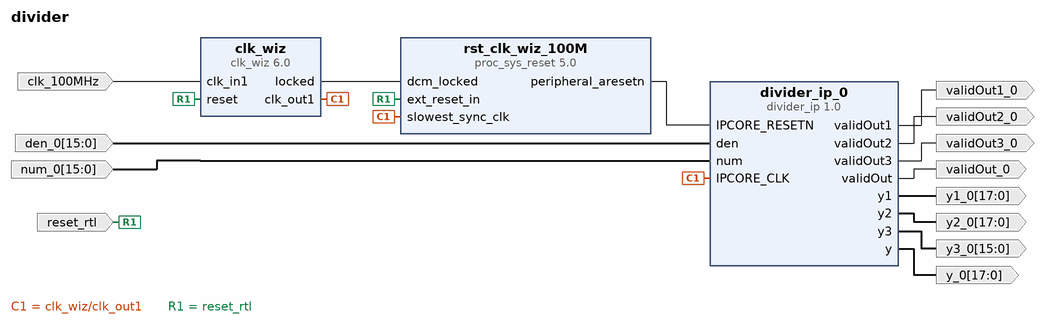
[diagram p0: block diagram of the top level]
# Vivado block design divider, xc7z010clg400-1, Vivado 2023.2
create_bd_design divider

create_bd_port -dir I -type clk clk_100MHz
set_property -dict {CONFIG.FREQ_HZ 100000000} [get_bd_ports clk_100MHz]
create_bd_port -dir I -type rst reset_rtl
set_property -dict {CONFIG.POLARITY ACTIVE_HIGH} [get_bd_ports reset_rtl]
create_bd_port -dir I -from 15 -to 0 den_0
create_bd_port -dir I -from 15 -to 0 num_0
create_bd_port -dir O validOut_0
create_bd_port -dir O validOut1_0
create_bd_port -dir O validOut2_0
create_bd_port -dir O validOut3_0
create_bd_port -dir O -from 17 -to 0 y_0
create_bd_port -dir O -from 17 -to 0 y1_0
create_bd_port -dir O -from 17 -to 0 y2_0
create_bd_port -dir O -from 15 -to 0 y3_0

create_bd_cell -type ip -vlnv user.org:ip:divider_ip:1.0 divider_ip_0
create_bd_cell -type ip -vlnv xilinx.com:ip:clk_wiz:6.0 clk_wiz
create_bd_cell -type ip -vlnv xilinx.com:ip:proc_sys_reset:5.0 rst_clk_wiz_100M

# ---- connections ----

connect_bd_net [get_bd_ports clk_100MHz] [get_bd_pins clk_wiz/clk_in1]
connect_bd_net [get_bd_pins clk_wiz/clk_out1] [get_bd_pins divider_ip_0/IPCORE_CLK] [get_bd_pins rst_clk_wiz_100M/slowest_sync_clk]
connect_bd_net [get_bd_pins clk_wiz/locked] [get_bd_pins rst_clk_wiz_100M/dcm_locked]
connect_bd_net -net den_0_1 [get_bd_ports den_0] [get_bd_pins divider_ip_0/den]
connect_bd_net [get_bd_pins divider_ip_0/validOut] [get_bd_ports validOut_0]
connect_bd_net [get_bd_pins divider_ip_0/validOut1] [get_bd_ports validOut1_0]
connect_bd_net [get_bd_pins divider_ip_0/validOut2] [get_bd_ports validOut2_0]
connect_bd_net [get_bd_pins divider_ip_0/validOut3] [get_bd_ports validOut3_0]
connect_bd_net [get_bd_pins divider_ip_0/y] [get_bd_ports y_0]
connect_bd_net [get_bd_pins divider_ip_0/y1] [get_bd_ports y1_0]
connect_bd_net [get_bd_pins divider_ip_0/y2] [get_bd_ports y2_0]
connect_bd_net [get_bd_pins divider_ip_0/y3] [get_bd_ports y3_0]
connect_bd_net -net num_0_1 [get_bd_ports num_0] [get_bd_pins divider_ip_0/num]
connect_bd_net [get_bd_ports reset_rtl] [get_bd_pins clk_wiz/reset] [get_bd_pins rst_clk_wiz_100M/ext_reset_in]
connect_bd_net [get_bd_pins rst_clk_wiz_100M/peripheral_aresetn] [get_bd_pins divider_ip_0/IPCORE_RESETN]

validate_bd_design
save_bd_design
